# Altium schematic sheet 2_Sensors.SchDoc
size A4
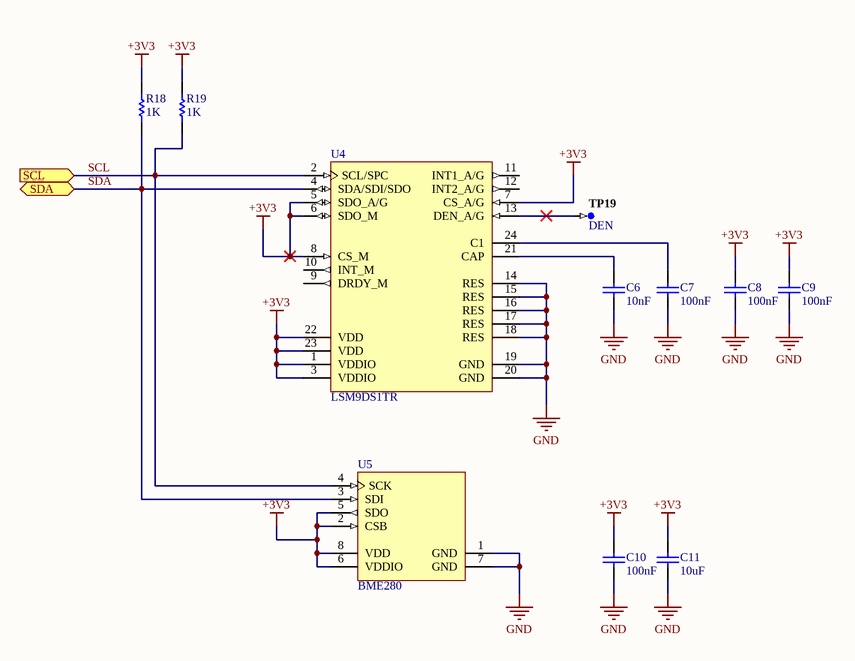
[diagram p0: 2_Sensors.SchDoc]

## Parts
C6  10nF  [CAPC0603(1608)100_M]
C7  100nF  [CAPC0603(1608)100_M]
C8  100nF  [CAPC0603(1608)100_M]
C9  100nF  [CAPC0603(1608)100_M]
C10  100nF  [CAPC0603(1608)100_M]
C11  10uF  [CAPC1206(3216)130_L]
R18  1K  [RESC0603(1608)_M]
R19  1K  [RESC0603(1608)_M]
TP19  DEN  [TP-SM-C-100]  (no BOM)
U4  LSM9DS1TR  [STM-LGA-24_3500X3000X1000]
U5  BME280  [BOSC-BME280-8_V]

## Ports
SCL (in), SDA (bidir)

## Nets
+3V3: C8.1 C9.1 C10.1 C11.2 R18.2 R19.2 U4.1(VDDIO) U4.3(VDDIO) U4.5(SDO_A/G) U4.6(SDO_M) U4.7(CS_A/G) U4.8(CS_M) U4.22(VDD) U4.23(VDD) U5.2(CSB) U5.5(SDO) U5.6(VDDIO) U5.8(VDD)
GND: C6.1 C7.2 C8.2 C9.2 C10.2 C11.1 U4.14(RES) U4.15(RES) U4.16(RES) U4.17(RES) U4.18(RES) U4.19(GND) U4.20(GND) U5.1(GND) U5.7(GND)
SCL: R19.1 U4.2(SCL/SPC) U5.4(SCK) ; port SCL
SDA: R18.1 U4.4(SDA/SDI/SDO) U5.3(SDI) ; port SDA
NetC6_2: C6.2 U4.21(CAP)
NetC7_1: C7.1 U4.24(C1)
NetTP19_1: TP19.1 U4.13(DEN_A/G)

Not connected (* = marked no-connect by the designer): U4 9(DRDY_M) 10(INT_M) 11(INT1_A/G) 12(INT2_A/G)

## Library data of the parts
C6 = CMP-1035-02316-1: CAP 10nF 25V ±5% 0603 (1608 Metric) Thickness 1mm SMD; Tolerance: Â±5%; Case-EIA: 0603; Case-Metric: 1608; Rated Voltage: 25 V; Technology: SMT; Max Thickness: 1 mm; Value: 10nF
C7-C10 = CMP-1035-02589-1: CAP 100nF 25V ±20% 0603 (1608 Metric) Thickness 1mm SMD; Case-EIA: 0603; Tolerance: Â±20%; Case-Metric: 1608; Value: 100nF; Max Thickness: 1 mm; Technology: SMT; Rated Voltage: 25 V
C11 = CMP-1037-04977-1: CAP 10uF 16V -20% to +80% 1206 (3216 Metric) Thickness 1.3mm SMD; Case-EIA: 1206; Case-Metric: 3216; Rated Voltage: 16 V; Tolerance: -20% to +80%; Technology: SMT; Value: 10uF; Max Thickness: 1.3 mm
R18 R19 = CMP-1012-00510-1: 1K 0.1W 1% 0603 (1608 Metric)  SMD; Case-Metric: 1608; Case-EIA: 0603; Value: 1000.00 Ohm; Technology: SMT; Tolerance: 1 %; Power: 0.1 W
TP19 = CMP-0484-00002-2: Test Point, Surface Mount, Circular, Pad Diameter 1 mm; Manufacturer: No Vendor; PartNumber: TP-SM-C-100
U4 = CMP-2000-06606-1: iNEMO Inertial Module: 3D Accelerometer, 3D Gyroscope, 3D Magnetometer, 1.9 to 3.6 V, -40 to 85 degC, 24-Pin LGA, RoHS, Tape and Reel; Manufacturer: STMicroelectronics; SVHC: NoSVHC(17-Dec-2015); MEMS Module Function: Tri-AxisGyroscope,Tri-AxisAccelerometer,Tri-AxisMagnetometer; Supply Voltage Max: 3.6V; No. of Pins: 24Pins; Gyroscope Range: ±245°/s,±500°/s,±2000°/s; Acceleration Range: ±2g,±4g,±8g,±16g; Supply Voltage Min: 1.9V; Package Description: 24-Pin Plastic Land Grid Array Package, Body 3.65 x 3.15 mm, Pitch 0.43 mm; Manufacturer URL: http://www.st.com/; PartNumber: LSM9DS1; Product Range: -; Packaging: CutTape; Sensor Case Style: LGA; Datasheet URL: http://www2.st.com/content/ccc/resource/technical/document/datasheet/1e/3f/2a/d6/25/eb/48/46/DM00103319.pdf/files/DM00103319.pdf/jcr:content/translations/en.DM00103319.pdf; Package Reference: LGA-24_3500X3000X1000; Mounting Technology: SurfaceMount; Datasheet Version: Rev. 3, 03/2015; MSL: MSL3-168hours
U5 = CMP-2000-05073-1: Combined Humidity and Pressure Sensor, 1.71 to 3.6 V, -40 to 85 degC, 8-Pin SMD, RoHS, Tape and Reel; Manufacturer: Bosch Sensortec; Datasheet Version: Rev. 1.2, 10/2015; Datasheet URL: http://datasheet.octopart.com/BME280-Bosch-datasheet-58577763.pdf; Manufacturer URL: http://www.bosch-sensortec.com